# EAGLE design PCB_TA (EAGLE 9.6.2)
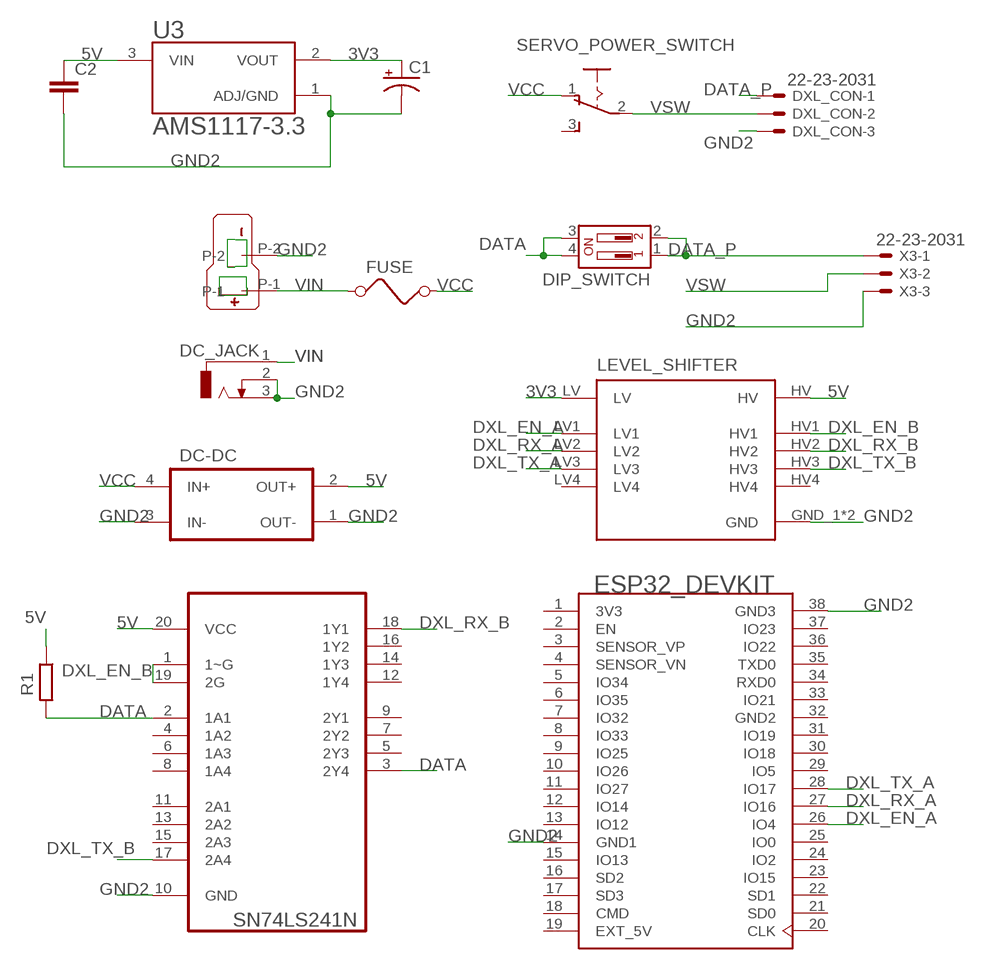
[diagram p0: schematic, sheet 1]

## Parts
BUCK_CONVERTER  DC-DC_CONV  [DC-DC_CONV]
C1  CPOL-USE3.5-8  [E3,5-8]
C2  C-EU025-025X050  [C025-025X050]
DC_JACK  DCJ0202  [DCJ0202]
DIP_SWITCH  DIP-02-PTH-100MIL  [DIPSWITCH-02-209-2LPST]
DXL_CON  22-23-2031  [22-23-2031]
ESP32_DEVKIT  ESP32-DEVKITC  [MODULE_ESP32-DEVKITC]
FUSE  FUSE  [FUSE]
LEVEL_SHIFTER  BOB-12009  [CONV_BOB-12009]
R1  R-EU_R0805  [R0805]
SERVO_POWER_SWITCH  255SB  [255SB]
U2  SN74LS241N  [DIP254P762X508-20]
U3  AMS1117-3.3  [SOT229P700X180-4N]
U$1  T-PLUG_CONNECTOR  [T_PLUG_CONNECTOR]
X3  22-23-2031  [22-23-2031]

## Nets
3V3: C1.+ LEVEL_SHIFTER.LV U3.2(VOUT)
5V: BUCK_CONVERTER.2(OUT+) C2.1 LEVEL_SHIFTER.HV R1.1 U2.20(VCC) U3.3(VIN)
DATA: DIP_SWITCH.3 DIP_SWITCH.4 R1.2 U2.2(1A1) U2.3(2Y4)
DATA_P: DIP_SWITCH.1 DIP_SWITCH.2 DXL_CON.1 X3.1
DXL_EN_A: ESP32_DEVKIT.26(IO4) LEVEL_SHIFTER.LV1
DXL_EN_B: LEVEL_SHIFTER.HV1 U2.1(1~G) U2.19(2G)
DXL_RX_A: ESP32_DEVKIT.27(IO16) LEVEL_SHIFTER.LV2
DXL_RX_B: LEVEL_SHIFTER.HV2 U2.18(1Y1)
DXL_TX_A: ESP32_DEVKIT.28(IO17) LEVEL_SHIFTER.LV3
DXL_TX_B: LEVEL_SHIFTER.HV3 U2.17(2A4)
GND2: BUCK_CONVERTER.1(OUT-) BUCK_CONVERTER.3(IN-) C1.- C2.2 DC_JACK.2 DC_JACK.3 DXL_CON.3 ESP32_DEVKIT.14(GND1) ESP32_DEVKIT.38(GND3) LEVEL_SHIFTER.GND_1(GND) LEVEL_SHIFTER.GND_2(GND) U2.10(GND) U3.1(ADJ/GND) U$1.P-2 X3.3
VCC: BUCK_CONVERTER.4(IN+) FUSE.2 SERVO_POWER_SWITCH.1(O)
VIN: DC_JACK.1 FUSE.1 U$1.P-1
VSW: DXL_CON.2 SERVO_POWER_SWITCH.2(P) X3.2
Unconnected: ESP32_DEVKIT.2(EN) ESP32_DEVKIT.3(SENSOR_VP) ESP32_DEVKIT.4(SENSOR_VN) ESP32_DEVKIT.5(IO34) ESP32_DEVKIT.6(IO35) ESP32_DEVKIT.7(IO32) ESP32_DEVKIT.8(IO33) ESP32_DEVKIT.9(IO25) ESP32_DEVKIT.10(IO26) ESP32_DEVKIT.11(IO27) ESP32_DEVKIT.12(IO14) ESP32_DEVKIT.13(IO12) ESP32_DEVKIT.15(IO13) ESP32_DEVKIT.16(SD2) ESP32_DEVKIT.17(SD3) ESP32_DEVKIT.18(CMD) ESP32_DEVKIT.20(CLK) ESP32_DEVKIT.21(SD0) ESP32_DEVKIT.22(SD1) ESP32_DEVKIT.23(IO15) ESP32_DEVKIT.24(IO2) ESP32_DEVKIT.25(IO0) ESP32_DEVKIT.29(IO5) ESP32_DEVKIT.30(IO18) ESP32_DEVKIT.31(IO19) ESP32_DEVKIT.33(IO21) ESP32_DEVKIT.34(RXD0) ESP32_DEVKIT.35(TXD0) ESP32_DEVKIT.36(IO22) ESP32_DEVKIT.37(IO23) LEVEL_SHIFTER.HV4 LEVEL_SHIFTER.LV4 SERVO_POWER_SWITCH.3(S) U2.4(1A2) U2.5(2Y3) U2.6(1A3) U2.7(2Y2) U2.8(1A4) U2.9(2Y1) U2.11(2A1) U2.12(1Y4) U2.13(2A2) U2.14(1Y3) U2.15(2A3) U2.16(1Y2)

## Power pins joined to a net without a drawn wire
3V3: ESP32_DEVKIT.1(3V3)
EXT_5V: ESP32_DEVKIT.19(EXT_5V)
GND2: ESP32_DEVKIT.32(GND2)

## Library data of the parts
BUCK_CONVERTER = devkrzyzanowskiLib:DC-DC_CONV
C1 = rcl:CPOL-US: POLARIZED CAPACITOR, American symbol; SPICEPREFIX: C
C2 = rcl:C-EU: CAPACITOR, European symbol; SPICEPREFIX: C
DC_JACK = con-jack:DCJ0202: DC POWER JACK Source: DCJ0202.pdf; OC_FARNELL: unknown; OC_NEWARK: unknown
DIP_SWITCH = SparkFun-Switches:DIP-02: 2-Position DIP Switch 2-circuit DIP (dual inline package) switch. Commonly used to physcially set a circuit's behavior. Variants PTH-100MIL - Through-hole, 0.1"-Pitch Used on SparkFun Stepoko <https://www.sparkfun.com/products/13899> (ROB-13899) SMD-50MIL-JWING - SMD (J-Wing Pads), 0.05"-Pitch Prototype Part SMD-50MIL - SMD, 0.05"-Pitch Used on SparkFun Battery Babysitter <https://www.sparkfun.com/products/13777> (PRT-13777); PROD_ID: SWCH-12532
DXL_CON X3 = con-molex:22-23-2031: .100" (2.54mm) Center Header - 3 Pin; MF: MOLEX; MPN: 22-23-2031; OC_FARNELL: 1462950; OC_NEWARK: 30C0862
ESP32_DEVKIT = ESP32-DEVKITC (1):ESP32-DEVKITC: ESP32-DEVKITC Check availability <https://pricing.snapeda.com/parts/ESP32-DEVKITC/Olimex%20LTD/view-part?ref=eda>; AVAILABILITY: In Stock; DESCRIPTION: ESP32-WROOM32 series Transceiver; 802.11 b/g/n (Wi-Fi, WiFi, WLAN), Bluetooth® Smart 4.x Low Energy (BLE) Evaluation Board; MF: Olimex LTD; MP: ESP32-DEVKITC; PACKAGE: None; PRICE: None; PURCHASE-URL: https://pricing.snapeda.com/search/part/ESP32-DEVKITC/?ref=eda
FUSE = special:FUSE: FUSE 5 x 20 mm
LEVEL_SHIFTER = BOB-12009:BOB-12009: Logic Level Converter - Bi-Direc Check availability <https://pricing.snapeda.com/parts/BOB-12009/SparkFun/view-part?ref=eda>; AVAILABILITY: In Stock; DESCRIPTION: BSS138 Logic-Level Translator Interface Evaluation Board; MF: SparkFun; MP: BOB-12009; PACKAGE: None; PRICE: None; PURCHASE-URL: https://pricing.snapeda.com/search/part/BOB-12009/?ref=eda
R1 = rcl:R-EU_: RESISTOR, European symbol; SPICEPREFIX: R
SERVO_POWER_SWITCH = switch:255SB: SLIDING SWITCH Distributor Buerklin, 11G810
U2 = SN74LS241N:SN74LS241N: OCTAL BUFFERS AND LINE DRIVERS WITH 3-STATE OUTPUTS Check availability <https://pricing.snapeda.com/parts/SN74LS241N/Texas%20Instruments/view-part?ref=eda>; AVAILABILITY: In Stock; DESCRIPTION: 8-ch, 4.75-V to 5.25-V bipolar buffers with 3-state outputs; MF: Texas Instruments; MP: SN74LS241N; PACKAGE: PDIP-20 Texas Instruments; PRICE: None; PURCHASE-URL: https://pricing.snapeda.com/search/part/SN74LS241N/?ref=eda
U3 = AMS1117-3.3:AMS1117-3.3: Sot223/Pkg 1-Amp 3.3-Volt Low Drop Out Voltage Regulatator Check availability <https://pricing.snapeda.com/parts/AMS1117-3.3/Advanced%20Monolithic%20Systems/view-part?ref=eda>; AVAILABILITY: Not in stock; DESCRIPTION: LDO Voltage Regulators 800MA LDO LINEAR REG; MF: Advanced Monolithic Systems; MP: AMS1117-3.3; PACKAGE: None; PRICE: None
U$1 = con-T-plug:T-PLUG_CONNECTOR

## Board
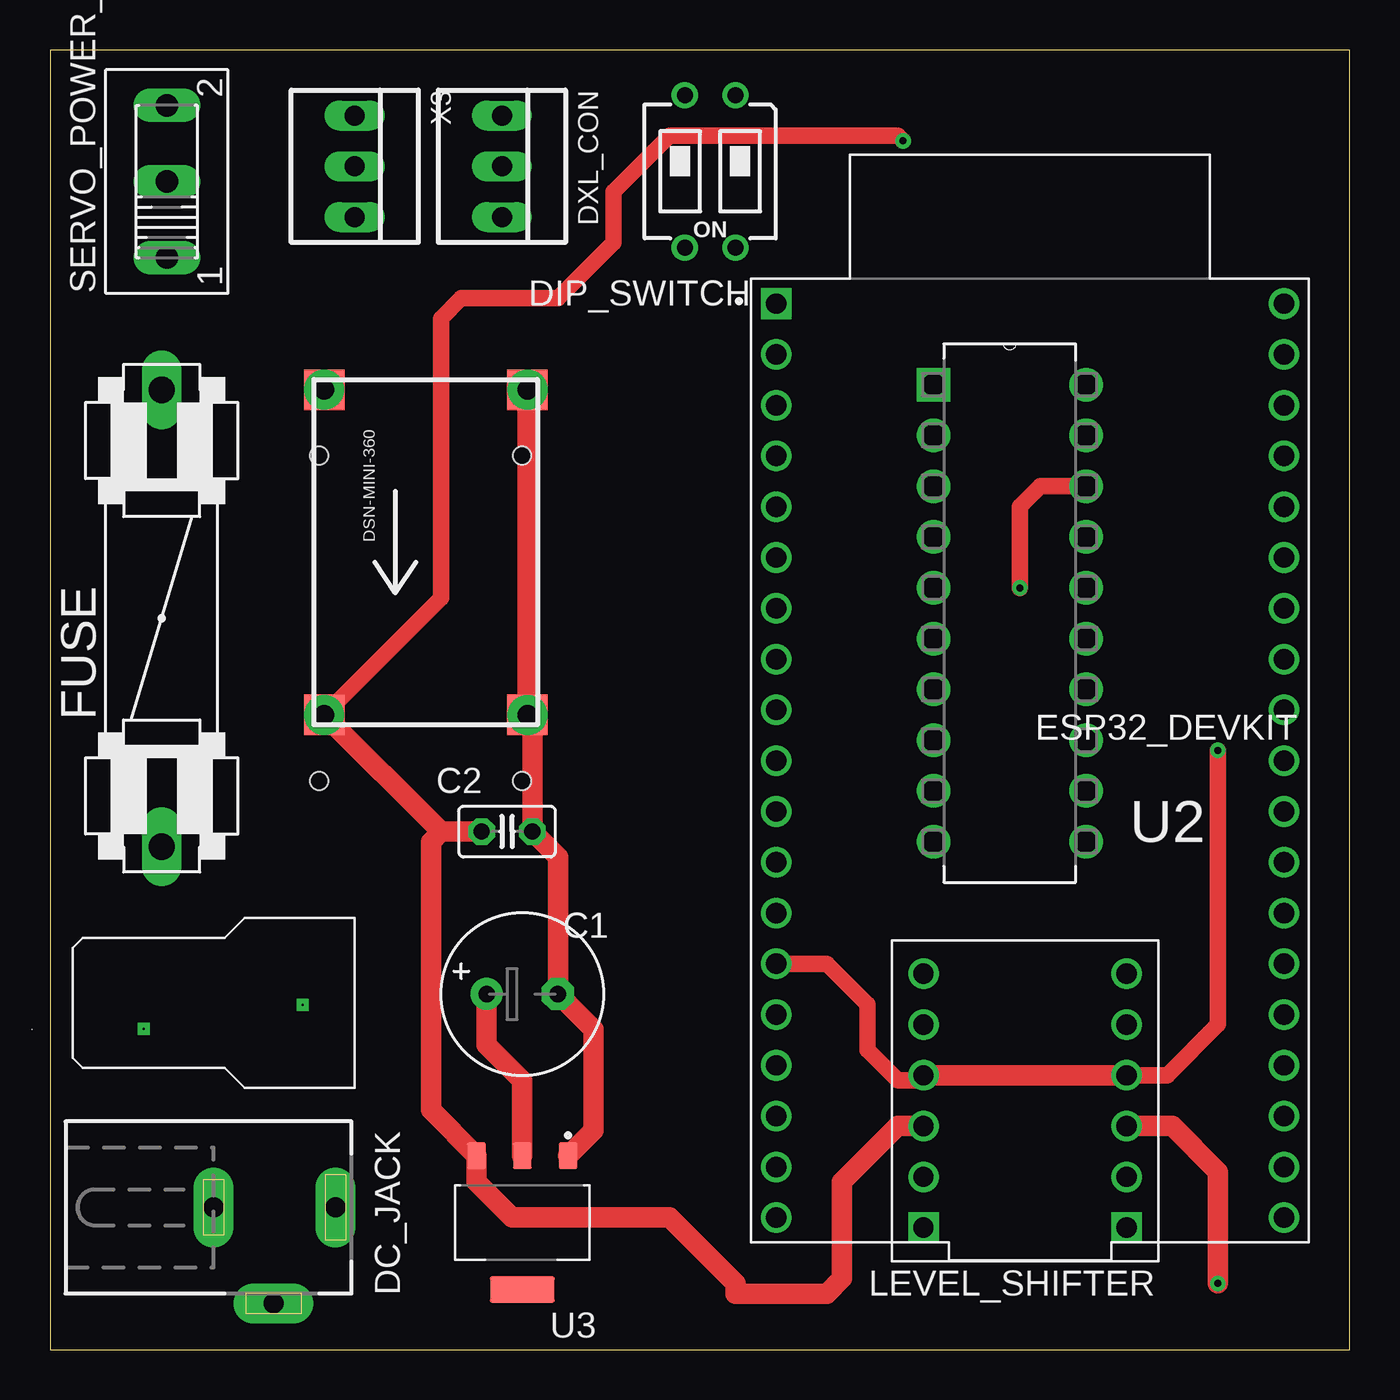
[diagram p1: board, top side]
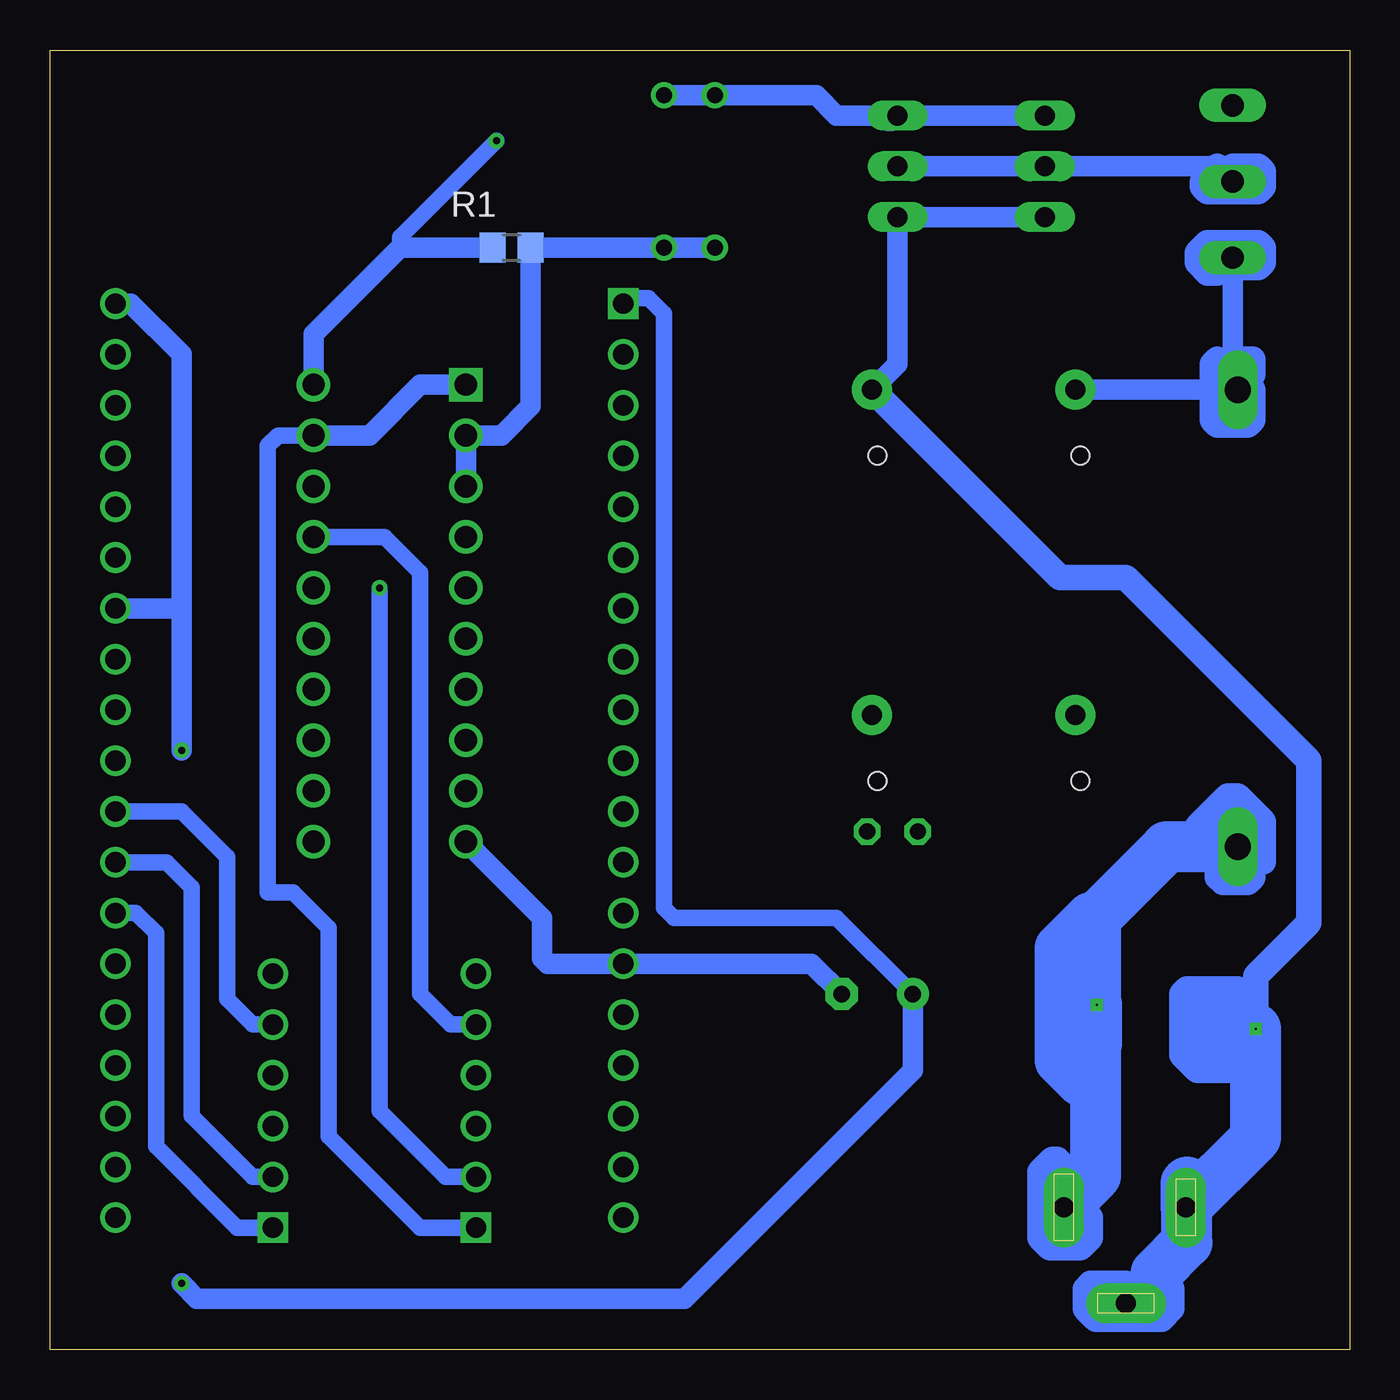
[diagram p2: board, bottom side, seen from below]

Size 65 x 65 mm. Coordinates in mm from the lower left corner, seen from the top.
Outline: 0,0 65,0 65,65 0,65 0,0
Copper layers (1*16): Top 0.035mm / dielectric 1.5mm / Bottom 0.035mm
Design rules "default": minimum track width 6mil, minimum drill 0.35mm, track to track 6mil, track to pad 6mil, pad to pad 6mil, via to via 6mil, smd to smd 6mil, copper to edge 40mil, drill to drill 6mil, minimum pad ring 10mil, minimum via ring 8mil, stop-mask expansion 4mil, vias tented up to drill 0mil, thermal gap 10mil
Holes 0.9 mm at 13.46,28.45 13.46,44.7 23.62,44.7 23.62,28.45

### Footprints (pad centres in the part's own frame; a part is rotated, then mirrored left to right if it is on the bottom)
DC-DC_CONV = smd 2.032 x 2.032: 1 -5.08,8.128; 2 5.08,8.128; 3 -5.08,-8.128; 4 5.08,-8.128
E3,5-8 = drill 0.813 pad 1.6: + -1.778,0 | drill 0.813 pad 1.6 octagon: - 1.778,0
C025-025X050 = drill 0.813 octagon: 1 -1.27,0; 2 1.27,0
DCJ0202 = drill 1 pad 2 long: 1 0,3.1; 2 4.8,0; 3 0,-3
DIPSWITCH-02-209-2LPST = drill 0.8: 1 -1.27,-3.81; 2 1.27,-3.81; 3 1.27,3.81; 4 -1.27,3.81
22-23-2031 = drill 1 long: 1 -2.54,0; 2 0,0; 3 2.54,0
MODULE_ESP32-DEVKITC = drill 1.02 square: 1 -12.7,22.85 | drill 1.02: 2 -12.7,20.31; 3 -12.7,17.77; 4 -12.7,15.23; 5 -12.7,12.69; 6 -12.7,10.15; 7 -12.7,7.61; 8 -12.7,5.07; 9 -12.7,2.53; 10 -12.7,-0.01; 11 -12.7,-2.55; 12 -12.7,-5.09; 13 -12.7,-7.63; 14 -12.7,-10.17; 15 -12.7,-12.71; 16 -12.7,-15.25; 17 -12.7,-17.79; 18 -12.7,-20.33; 19 -12.7,-22.87; 20 12.7,-22.87; 21 12.7,-20.33; 22 12.7,-17.79; 23 12.7,-15.25; 24 12.7,-12.71; 25 12.7,-10.17; 26 12.7,-7.63; 27 12.7,-5.09; 28 12.7,-2.55; 29 12.7,-0.01; 30 12.7,2.53; 31 12.7,5.07; 32 12.7,7.61; 33 12.7,10.15; 34 12.7,12.69; 35 12.7,15.23; 36 12.7,17.77; 37 12.7,20.31; 38 12.7,22.85
FUSE = drill 1.321 long: 1 -11.43,0; 2 11.43,0
CONV_BOB-12009 = drill 1.016: GND_1 5.08,-1.27; GND_2 -5.08,-1.27; HV 5.08,1.27; HV2 5.08,3.81; HV3 5.08,-3.81; HV4 5.08,-6.35; LV -5.08,1.27; LV2 -5.08,3.81; LV3 -5.08,-3.81; LV4 -5.08,-6.35 | drill 1.016 square: HV1 5.08,6.35; LV1 -5.08,6.35
R0805 = smd 1.3 x 1.5: 1 -0.95,0; 2 0.95,0
255SB = drill 1.118 long: 1 -3.81,0; 2 0,0; 3 3.81,0
DIP254P762X508-20 = drill 1.118 square: 1 -7.62,22.86 | drill 1.118: 2 -7.62,20.32; 3 -7.62,17.78; 4 -7.62,15.24; 5 -7.62,12.7; 6 -7.62,10.16; 7 -7.62,7.62; 8 -7.62,5.08; 9 -7.62,2.54; 10 -7.62,0; 11 0,0; 12 0,2.54; 13 0,5.08; 14 0,7.62; 15 0,10.16; 16 0,12.7; 17 0,15.24; 18 0,17.78; 19 0,20.32; 20 0,22.86
SOT229P700X180-4N = smd 0.93 x 1.31: 1 -2.29,-3.345; 2 0,-3.345; 3 2.29,-3.345 | smd 3.24 x 1.31: 4 0,3.345
T_PLUG_CONNECTOR = drill 0.1 square: P-1 2.6,4.35; P-2 10.55,5.55

### Placement (x,y rotation side)
BUCK_CONVERTER  18.8,39.88 180 top
C1  23.62,17.78 0 top
C2  22.86,25.91 0 top
DC_JACK  11.18,7.11 270 top
DIP_SWITCH  33.02,58.93 180 top
DXL_CON  22.61,59.18 270 top
ESP32_DEVKIT  49.02,29.46 0 top
FUSE  5.59,36.58 90 top
LEVEL_SHIFTER  48.77,12.45 180 top
R1  41.91,55.12 0 bottom
SERVO_POWER_SWITCH  5.84,58.42 90 top
U2  51.82,25.4 0 top
U3  23.62,6.35 180 top
U$1  15.24,21.59 180 top
X3  15.24,59.18 270 top

### Tracks (layer width: path | path; a pad name or v marks a point on that pad's centre or on a via)
3V3  (via drill 0.35)
  Top 1.016: C1.+ 21.84,15.24 23.62,13.46 U3.2 | v58.42,3.3 58.42,8.89 56.13,11.18 LEVEL_SHIFTER.LV
  Bottom 0.813: C1.+ 25.65,21.59 33.78,21.59 34.29,22.1 34.29,51.82 35.05,52.58 36.06,52.58 ESP32_DEVKIT.1
  Bottom 1.016: C1.+ 21.84,13.97 33.27,2.54 57.66,2.54 v58.42,3.3
5V  (via drill 0.35, 1 pad 2)
  Top 0.813: BUCK_CONVERTER.2 19.56,37.59 19.56,51.56 20.57,52.58 25.4,52.58 28.19,55.37 28.19,57.91 30.99,60.71 42.42,60.71 v42.67,60.45
  Top 1.016: BUCK_CONVERTER.2 19.56,25.91 | 19.56,25.91 C2.1 | 19.56,25.91 19.05,25.4 19.05,11.98 U3.3 21.33,8.39 23.11,6.6 30.99,6.6 34.29,3.3 34.29,2.79 38.86,2.79 39.62,3.56 39.62,8.38 42.42,11.18 LEVEL_SHIFTER.HV
  Bottom 0.813: v42.67,60.45 47.5,55.63 47.5,55.12
  Bottom 1.016: R1.1 47.5,55.12 51.82,50.8 U2.20
  other vias: 13.72,31.75 13.72,31.75
DATA
  Bottom 1.016: DIP_SWITCH.3 DIP_SWITCH.4 R1.2 40.96,47.18 42.42,45.72 U2.2 U2.3
DATA_P
  Bottom 1.016: X3.1 DXL_CON.1 | DXL_CON.1 22.86,61.72 23.11,61.47 22.86,61.47 DXL_CON.1 | DXL_CON.1 25.65,61.72 26.67,62.74 DIP_SWITCH.2 DIP_SWITCH.1
DXL_EN_A
  Bottom 0.813: LEVEL_SHIFTER.LV1 55.63,6.1 59.69,10.16 59.69,20.83 60.71,21.84 61.71,21.84 ESP32_DEVKIT.26
DXL_EN_B
  Bottom 0.813: LEVEL_SHIFTER.HV1 46.48,6.1 51.05,10.67 51.05,21.08 52.83,22.86 54.1,22.86 54.1,45.21 53.59,45.72 U2.19
  Bottom 1.016: U2.1 46.48,48.26 49.02,45.72 U2.19
DXL_RX_A
  Bottom 0.813: ESP32_DEVKIT.27 59.17,24.37 57.91,23.11 57.91,11.68 54.86,8.64 LEVEL_SHIFTER.LV2
DXL_RX_B  (via drill 0.35)
  Top 0.813: v48.51,38.1 48.51,42.16 49.53,43.18 U2.18
  Bottom 0.813: LEVEL_SHIFTER.HV2 45.21,8.64 48.51,11.94 v48.51,38.1
DXL_TX_A
  Bottom 0.813: LEVEL_SHIFTER.LV3 54.86,16.26 56.13,17.53 56.13,24.64 58.41,26.91 ESP32_DEVKIT.28
DXL_TX_B
  Bottom 0.813: LEVEL_SHIFTER.HV3 44.96,16.26 46.48,17.78 46.48,38.86 48.26,40.64 U2.17
GND2  (via drill 0.35, 1 pad 2)
  Top 0.813: ESP32_DEVKIT.14 38.87,19.29 40.89,17.27 40.89,14.99 42.42,13.46 43.43,13.46 LEVEL_SHIFTER.GND_1 | v58.42,29.97 58.42,16.26 55.88,13.72 LEVEL_SHIFTER.GND_2
  Top 1.016: BUCK_CONVERTER.3 BUCK_CONVERTER.1 24.13,31.5 C2.2 25.4,24.64 C1.- 27.18,16 27.18,10.96 U3.1 | LEVEL_SHIFTER.GND_1 LEVEL_SHIFTER.GND_2
  Bottom 1.016: X3.3 DXL_CON.3 22.61,49.28 BUCK_CONVERTER.3 | ESP32_DEVKIT.38 60.95,52.31 58.42,49.78 58.42,37.34 | ESP32_DEVKIT.32 58.68,37.07 58.42,37.34 | 58.42,37.34 v58.42,29.97 | C1.- 26.91,19.29 ESP32_DEVKIT.14 40.12,19.29 40.39,19.56 40.39,21.59 U2.10
  Bottom 1.27: U$1.P-2 4.69,18.68 2.03,21.34 2.03,29.46 11.18,38.61 14.48,38.61 BUCK_CONVERTER.3 | 9.66,3.82 8.89,3.05 8.89,2.03 9.4,1.52 12.7,1.52 13.21,2.03 13.21,3.05 12.95,3.3 11.18,3.3 DC_JACK.2 | U$1.P-2 8.34,16.04 8.38,16 8.38,14.73 7.62,13.97 5.33,13.97 5.33,14.99 7.62,14.99 8.38,15.75 8.38,17.78 8.13,18.03 5.59,18.03 5.59,17.02 7.37,17.02 6.39,16.04 U$1.P-2
  Bottom 2.54: U$1.P-2 4.69,10.6 DC_JACK.3 8.18,8.33 8.13,8.38 8.13,5.36 9.66,3.82
  other vias: 23.88,48.01 23.88,31.75
VCC  (via drill 1 pad 2)
  Bottom 1.016: 5.84,49.53 SERVO_POWER_SWITCH.1 | 6.86,48.01 BUCK_CONVERTER.4
  Bottom 1.27: FUSE.2 4.83,48.77 4.83,49.53 5.84,49.53 | FUSE.2 5.59,48.51 6.6,49.53 6.86,49.28 6.86,48.01 6.86,46.48 6.6,46.23 5.08,46.23 4.83,46.48 4.83,48.01 FUSE.2 | SERVO_POWER_SWITCH.1 6.6,53.85 7.11,53.85 7.62,54.36 7.62,54.86 7.11,55.37 4.57,55.37 4.32,55.12 4.32,54.36 4.57,54.1 5.33,54.1 SERVO_POWER_SWITCH.1
  other vias: 13.72,48.01
VIN
  Bottom 1.27: 6.86,26.92 6.6,26.67 6.6,23.62 6.35,23.37 5.08,23.37 4.83,23.62 4.83,24.38 | 6.86,26.92 6.1,27.69 5.59,27.69 4.32,26.42 4.32,24.38 4.83,24.38 | 4.83,24.38 FUSE.1 | 6.86,26.92 7.62,26.16 7.62,25.65 | DC_JACK.1 14.28,9.09 14.22,9.14 14.61,9.53 14.86,9.53 15.49,8.89 15.49,5.59 14.99,5.08 13.46,5.08 12.95,5.59 12.95,6.6 13.46,7.11 DC_JACK.1
  Bottom 2.54: FUSE.1 9.14,25.15 12.7,21.59 | 12.7,15.24 12.7,21.59 | 12.7,15.24 12.64,15.3 U$1.P-1 | DC_JACK.1 12.7,8.69 12.7,13.46 | 12.7,13.46 12.7,15.24 | 12.7,21.59 12.95,21.59 14.48,20.07 14.48,14.48 13.46,13.46 12.7,13.46
VSW
  Bottom 1.016: 6.6,59.18 X3.2 DXL_CON.2
  Bottom 1.27: SERVO_POWER_SWITCH.2 5.84,59.18 4.57,59.18 4.32,58.93 4.32,58.17 4.57,57.91 7.11,57.91 7.37,58.17 7.37,58.42 6.6,59.18

### Text on the board
_tNames: U2 | S1 | F1 | C2 | J1 | C1
_bNames: R1 | U1 | U3